# Altium schematic sheet 13 BOOT SELECT.SchDoc
size 513 x 386 mm
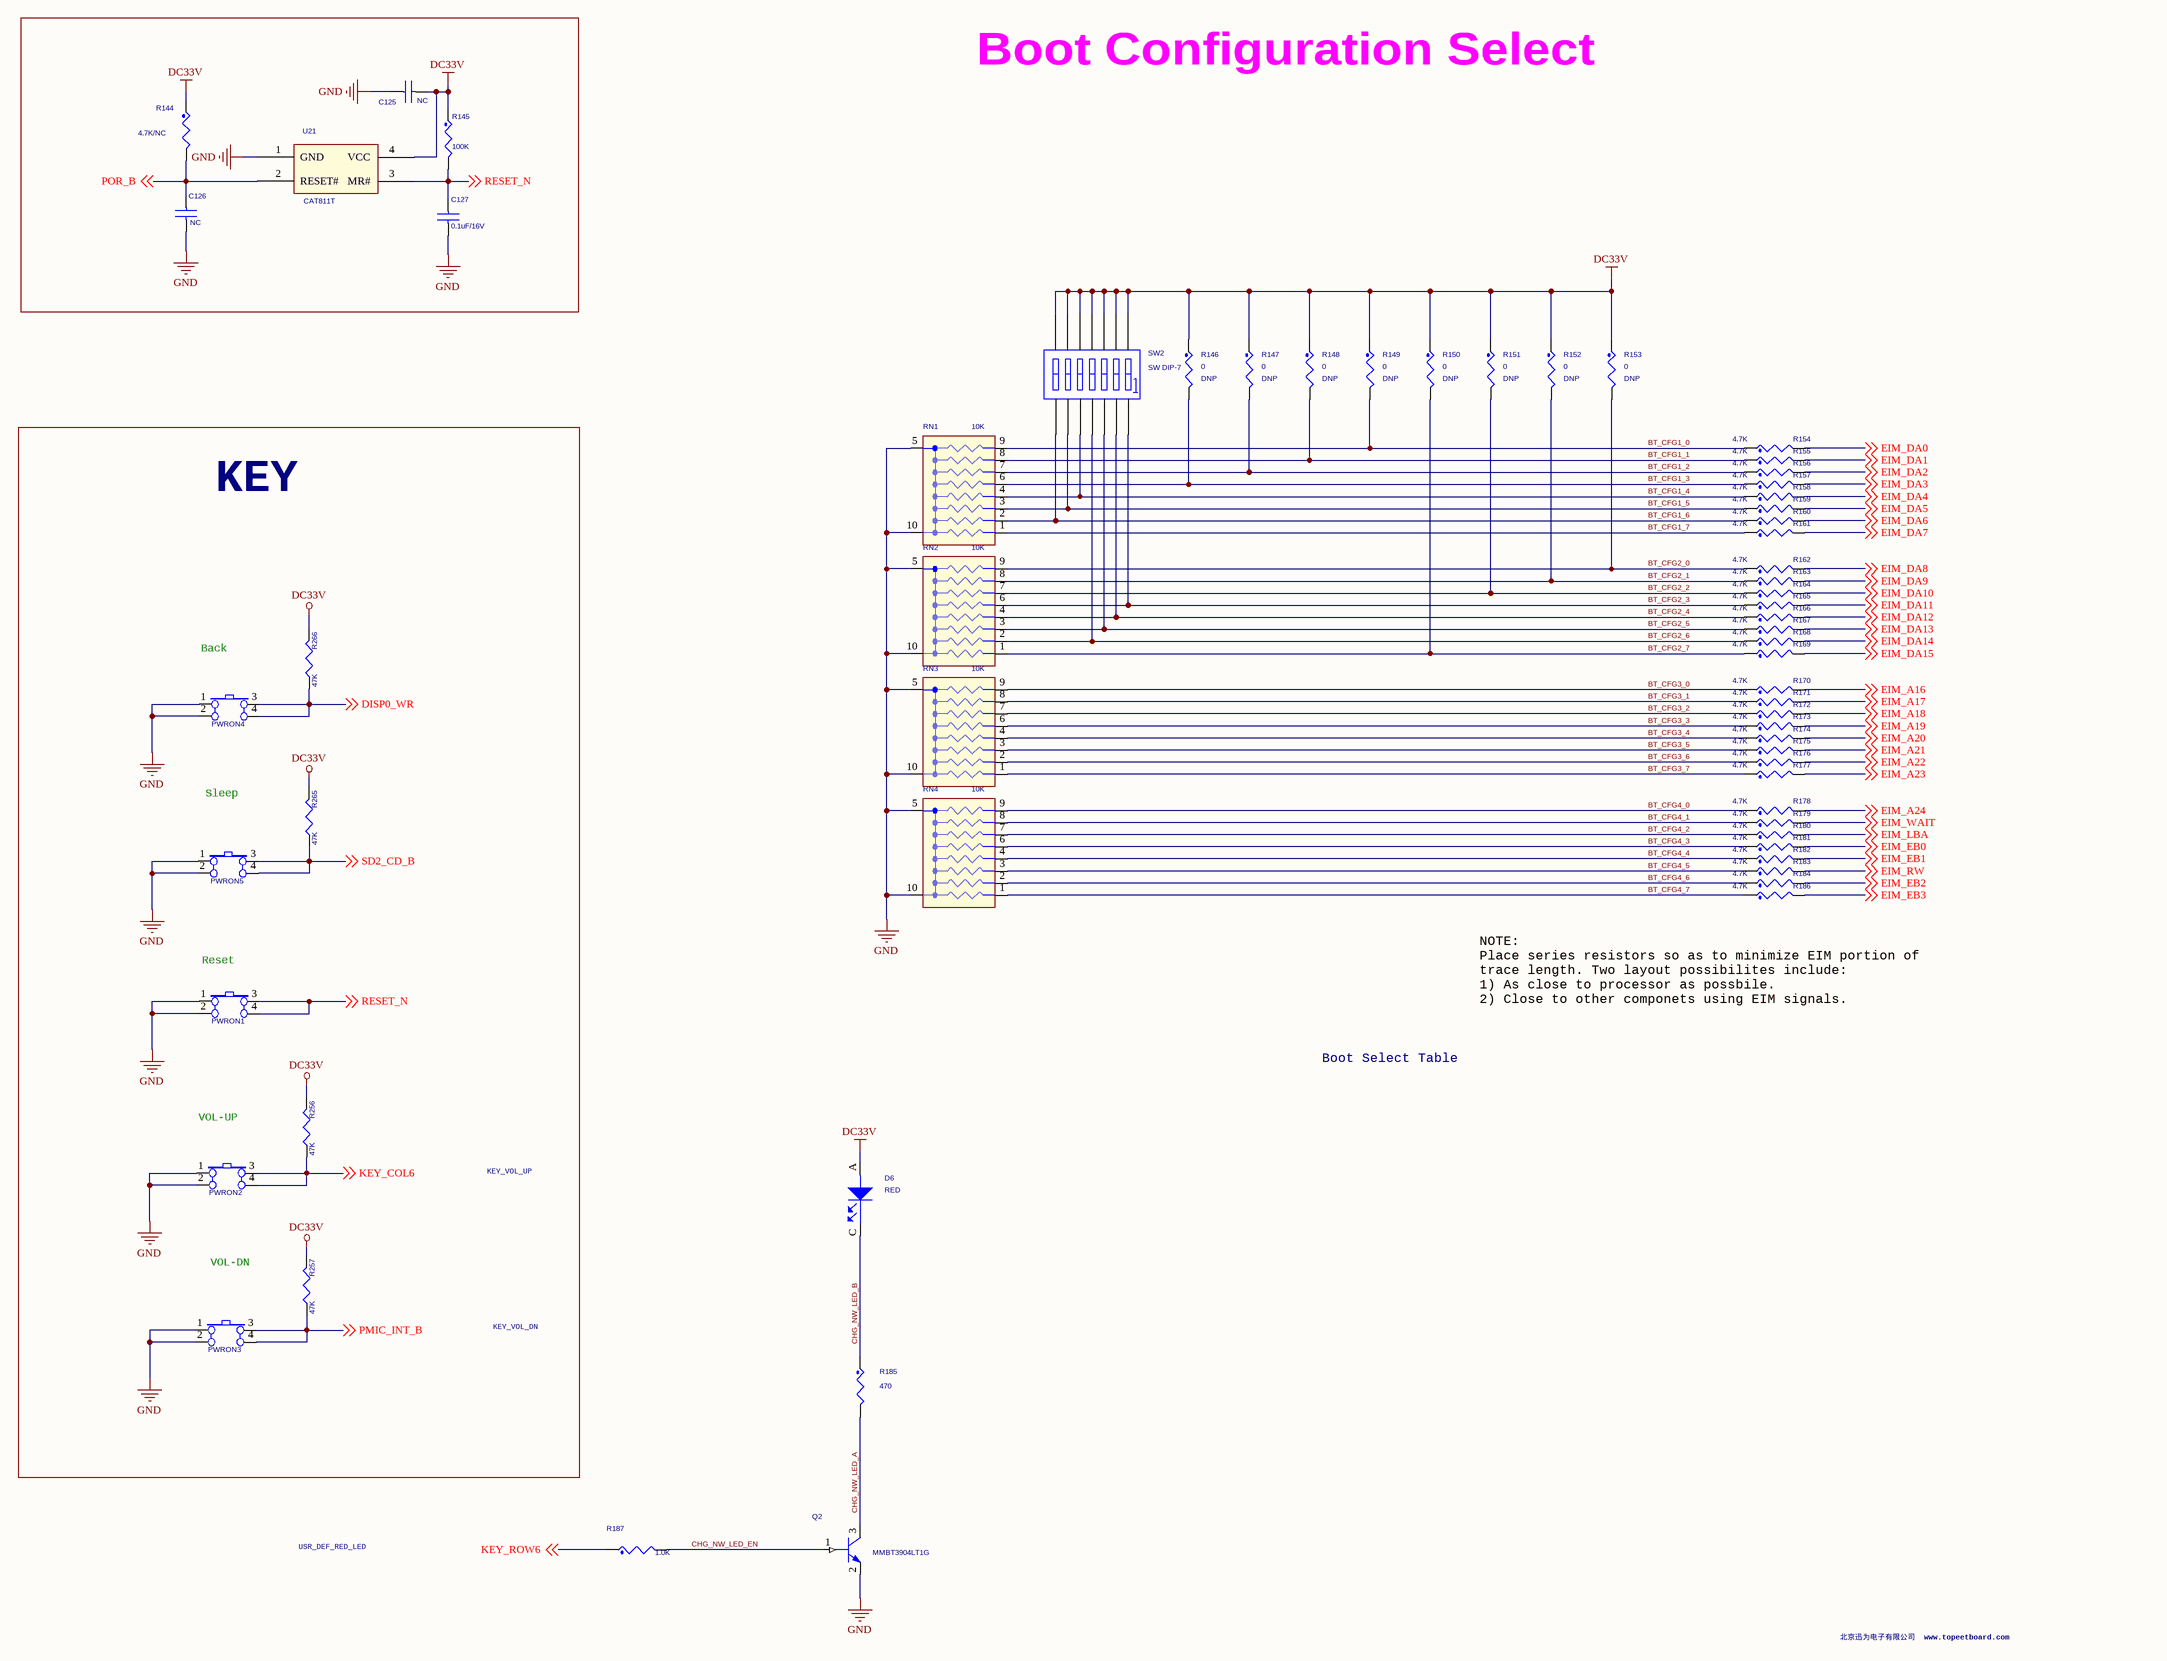
[diagram p0: 13 BOOT SELECT.SchDoc]

## Parts
C125  NC  [C0603]
C126  NC  [C0603]
C127  0.1uF/16V  [C0603]
D6  RED  [LED0603]
PWRON1  SW-TACT(RED)_1105S  [SW-TACT]  (value not drawn)
PWRON2  SW-TACT(RED)_1105S  [SW-TACT]  (value not drawn)
PWRON3  SW-TACT(RED)_1105S  [SW-TACT]  (value not drawn)
PWRON4  SW-TACT(RED)_1105S  [SW-TACT]  (value not drawn)
PWRON5  SW-TACT(RED)_1105S  [SW-TACT]  (value not drawn)
Q2  MMBT3904LT1G  [SOT23-mmbt3904]
R144  4.7K/NC  [R0402]
R145  100K  [R0402]
R146  0  ASSY_OPT: DNP  [R0402]
R147  0  ASSY_OPT: DNP  [R0402]
R148  0  ASSY_OPT: DNP  [R0402]
R149  0  ASSY_OPT: DNP  [R0402]
R150  0  ASSY_OPT: DNP  [R0402]
R151  0  ASSY_OPT: DNP  [R0402]
R152  0  ASSY_OPT: DNP  [R0402]
R153  0  ASSY_OPT: DNP  [R0402]
R154  4.7K  [R0402]
R155  4.7K  [R0402]
R156  4.7K  [R0402]
R157  4.7K  [R0402]
R158  4.7K  [R0402]
R159  4.7K  [R0402]
R160  4.7K  [R0402]
R161  4.7K  [R0402]
R162  4.7K  [R0402]
R163  4.7K  [R0402]
R164  4.7K  [R0402]
R165  4.7K  [R0402]
R166  4.7K  [R0402]
R167  4.7K  [R0402]
R168  4.7K  [R0402]
R169  4.7K  [R0402]
R170  4.7K  [R0402]
R171  4.7K  [R0402]
R172  4.7K  [R0402]
R173  4.7K  [R0402]
R174  4.7K  [R0402]
R175  4.7K  [R0402]
R176  4.7K  [R0402]
R177  4.7K  [R0402]
R178  4.7K  [R0402]
R179  4.7K  [R0402]
R180  4.7K  [R0402]
R181  4.7K  [R0402]
R182  4.7K  [R0402]
R183  4.7K  [R0402]
R184  4.7K  [R0402]
R185  470  [R0402]
R186  4.7K  [R0402]
R187  1.0K  [R0402]
R256  47K  [R1005]
R257  47K  [R1005]
R265  47K  [R1005]
R266  47K  [R1005]
RN1  10K  [RCA_8_10]
RN2  10K  [RCA_8_10]
RN3  10K  [RCA_8_10]
RN4  10K  [RCA_8_10]
SW2  SW DIP-7  [bmkg7]
U21  CAT811T  [sot143_CAT811T]

## Blocks framed on the sheet
KEY: PWRON1-PWRON5 R256 R257 R265 R266

## Nets
DC33V: C125.2 D6.A(ANODE) R144.1 R145.1 R146.1 R147.1 R148.1 R149.1 R150.1 R151.1 R152.1 R153.1 R256.2 R257.2 R265.2 R266.2 SW2.1(A1) SW2.2(A2) SW2.3(A3) SW2.4(A4) SW2.5(A5) SW2.6(A6) SW2.7(A7) U21.4(VCC)
GND: C125.1 C126.2 C127.2 PWRON1.1(I2) PWRON1.2(I3) PWRON2.1(I2) PWRON2.2(I3) PWRON3.1(I2) PWRON3.2(I3) PWRON4.1(I2) PWRON4.2(I3) PWRON5.1(I2) PWRON5.2(I3) Q2.2(EMITTER) RN1.5 RN1.10 RN2.5 RN2.10 RN3.5 RN3.10 RN4.5 RN4.10 U21.1(GND)
BT_CFG1_0: R149.2 R154.1 RN1.9
BT_CFG1_1: R148.2 R155.1 RN1.8
BT_CFG1_2: R147.2 R156.1 RN1.7
BT_CFG1_3: R146.2 R157.1 RN1.6
BT_CFG1_4: R158.1 RN1.4 SW2.10(B5)
BT_CFG1_5: R159.1 RN1.3 SW2.9(B6)
BT_CFG1_6: R160.1 RN1.2 SW2.8(B7)
BT_CFG1_7: R161.1 RN1.1
BT_CFG2_0: R153.2 R162.1 RN2.9
BT_CFG2_1: R152.2 R163.1 RN2.8
BT_CFG2_2: R151.2 R164.1 RN2.7
BT_CFG2_3: R165.1 RN2.6 SW2.14(B1)
BT_CFG2_4: R166.1 RN2.4 SW2.13(B2)
BT_CFG2_5: R167.1 RN2.3 SW2.12(B3)
BT_CFG2_6: R168.1 RN2.2 SW2.11(B4)
BT_CFG2_7: R150.2 R169.1 RN2.1
BT_CFG3_0: R170.1 RN3.9
BT_CFG3_1: R171.1 RN3.8
BT_CFG3_2: R172.1 RN3.7
BT_CFG3_3: R173.1 RN3.6
BT_CFG3_4: R174.1 RN3.4
BT_CFG3_5: R175.1 RN3.3
BT_CFG3_6: R176.1 RN3.2
BT_CFG3_7: R177.1 RN3.1
BT_CFG4_0: R178.1 RN4.9
BT_CFG4_1: R179.1 RN4.8
BT_CFG4_2: R180.1 RN4.7
BT_CFG4_3: R181.1 RN4.6
BT_CFG4_4: R182.1 RN4.4
BT_CFG4_5: R183.1 RN4.3
BT_CFG4_6: R184.1 RN4.2
BT_CFG4_7: R186.1 RN4.1
CHG_NW_LED_A: Q2.3(COLLECTOR) R185.2
CHG_NW_LED_B: D6.C(CATHODE) R185.1
CHG_NW_LED_EN: Q2.1(BASE) R187.2
DISP0_WR: PWRON4.3 PWRON4.4(I1) R266.1 ; off-sheet DISP0_WR
EIM_A16: R170.2 ; off-sheet EIM_A16
EIM_A17: R171.2 ; off-sheet EIM_A17
EIM_A18: R172.2 ; off-sheet EIM_A18
EIM_A19: R173.2 ; off-sheet EIM_A19
EIM_A20: R174.2 ; off-sheet EIM_A20
EIM_A21: R175.2 ; off-sheet EIM_A21
EIM_A22: R176.2 ; off-sheet EIM_A22
EIM_A23: R177.2 ; off-sheet EIM_A23
EIM_A24: R178.2 ; off-sheet EIM_A24
EIM_DA0: R154.2 ; off-sheet EIM_DA0
EIM_DA1: R155.2 ; off-sheet EIM_DA1
EIM_DA2: R156.2 ; off-sheet EIM_DA2
EIM_DA3: R157.2 ; off-sheet EIM_DA3
EIM_DA4: R158.2 ; off-sheet EIM_DA4
EIM_DA5: R159.2 ; off-sheet EIM_DA5
EIM_DA6: R160.2 ; off-sheet EIM_DA6
EIM_DA7: R161.2 ; off-sheet EIM_DA7
EIM_DA8: R162.2 ; off-sheet EIM_DA8
EIM_DA9: R163.2 ; off-sheet EIM_DA9
EIM_DA10: R164.2 ; off-sheet EIM_DA10
EIM_DA11: R165.2 ; off-sheet EIM_DA11
EIM_DA12: R166.2 ; off-sheet EIM_DA12
EIM_DA13: R167.2 ; off-sheet EIM_DA13
EIM_DA14: R168.2 ; off-sheet EIM_DA14
EIM_DA15: R169.2 ; off-sheet EIM_DA15
EIM_EB0: R181.2 ; off-sheet EIM_EB0
EIM_EB1: R182.2 ; off-sheet EIM_EB1
EIM_EB2: R184.2 ; off-sheet EIM_EB2
EIM_EB3: R186.2 ; off-sheet EIM_EB3
EIM_LBA: R180.2 ; off-sheet EIM_LBA
EIM_RW: R183.2 ; off-sheet EIM_RW
EIM_WAIT: R179.2 ; off-sheet EIM_WAIT
KEY_COL6: PWRON2.3 PWRON2.4(I1) R256.1 ; off-sheet KEY_COL6
KEY_ROW6: R187.1 ; off-sheet KEY_ROW6
PMIC_INT_B: PWRON3.3 PWRON3.4(I1) R257.1 ; off-sheet PMIC_INT_B
POR_B: C126.1 R144.2 U21.2(RESET#) ; off-sheet POR_B
RESET_N: C127.1 PWRON1.3 PWRON1.4(I1) R145.2 U21.3(MR#) ; off-sheet RESET_N
SD2_CD_B: PWRON5.3 PWRON5.4(I1) R265.1 ; off-sheet SD2_CD_B

## Notes on the sheet
- Boot Configuration Select
- Back
- Sleep
- NOTE:
  Place series resistors so as to minimize EIM portion of
  trace length. Two layout possibilites include:
  1) As close to processor as possbile.
  2) Close to other componets using EIM signals.
- (near PWRON1) Reset
- Boot Select Table
- VOL-UP
- KEY_VOL_UP
- VOL-DN
- KEY_VOL_DN
- USR_DEF_RED_LED
- 北京迅为电子有限公司  www.topeetboard.com

## Library data of the parts
C125-C127 = C0603_0_Dup1
D6 = LED: LED ULTRA BRIGHT RED SGL 30MA 0603; CAD_APPROVED: Yes; MFG_PN01: LTST-C190KRKT; MFG_NAME01: LITE ON; AGILE_PN: 370-75079; HEIGHT: 0.9MM; ROHS: Yes
PWRON1-PWRON5 = SW-TACT
Q2 = NPN: TRAN NPN GEN 200MA 40V SOT-23; CAD_APPROVED: Yes; MFG_NAME01: ON SEMICONDUCTOR; AGILE_PN: 480-75173; HEIGHT: 1.12 MM; ROHS: Yes; MFG_PN01: MMBT3904LT1G
R144 R185 = RES_Dup1: RES MF 470 OHM 1/10W 1% 0603; SIGNAL_MODEL: DEFAULT_RESISTOR_470OHM_2_1; FPLIST: RC0603_OV,RC0603,0603_CC; CAD_APPROVED: Yes; MFG_PN01: RK73H1JTTD4700F; MFG_NAME01: KOA SPEER; AGILE_PN: 470-30133; HEIGHT: 0.55 MM; ROHS: Yes; TOL: 1%; Tolerance: 1%
R145 = RES_Dup1: RES MF 470 OHM 1/10W 1% 0603; AGILE_PN: 470-30133; MFG_NAME01: KOA SPEER; MFG_PN01: RK73H1JTTD4700F; CAD_APPROVED: Yes; FPLIST: RC0603_OV,RC0603,0603_CC; SIGNAL_MODEL: DEFAULT_RESISTOR_470OHM_2_1; Tolerance: 1%; TOL: 1%; ROHS: Yes; HEIGHT: 0.55 MM
R146-R153 = RES_Dup1: RES MF ZERO OHM 1/10W -- 0402; SIGNAL_MODEL: DEFAULT_RESISTOR_0.001OHM_2_1; FPLIST: RC0402_25,RC0402_HD,RC0402_X2,0402_CC; CAD_APPROVED: Yes; MFG_PN01: ERJ-2GE0R00X; MFG_NAME01: Panasonic; AGILE_PN: 470-79965; ROHS: Yes
R154-R161 R163-R170 R178 = RES_Dup1: RES MF 4.70K 1/16W 1% 0402; AGILE_PN: 470-75418; MFG_NAME01: KOA SPEER; MFG_PN01: RK73H1ETTP4701F; CAD_APPROVED: Yes; PRIORITY_PN: 006-00619; SIGNAL_MODEL: DEFAULT_RESISTOR_4700OHM_2_1; Tolerance: 1%; ROHS: Yes
R162 R171-R177 R179-R184 R186 = RES_Dup1: RES MF 4.70K 1/16W 1% 0402; PRIORITY_PN: 006-00619; CAD_APPROVED: Yes; MFG_PN01: RK73H1ETTP4701F; MFG_NAME01: KOA SPEER; AGILE_PN: 470-75418; SIGNAL_MODEL: DEFAULT_RESISTOR_4700OHM_2_1; ROHS: Yes; Tolerance: 1%
R187 = RES_Dup1: RES MF 1.0K 1/16W 1% 0402; AGILE_PN: 470-76037; MFG_NAME01: YAGEO AMERICA; MFG_PN01: RC0402FR-071KL; CAD_APPROVED: Yes; FPLIST: RC0402_25,RC0402_HD,RC0402_X2,0402_CC; SIGNAL_MODEL: DEFAULT_RESISTOR_1000OHM_2_1; Tolerance: 1%; ROHS: Yes
R256 R257 R265 R266 = R1005_0_Dup2
RN1 RN2 = NETW_B8_10P: RNET BUS 8 10K 1/32W 5% SMT; PRIORITY_PN: 051-00078; FPLIST: RCA_8_10, mnr15; CAD_APPROVED: Yes; MFG_PN01: MNR15E0RPJ103; MFG_NAME01: ROHM; AGILE_PN: 470-75833; ROHS: Yes; Tolerance: 5%
RN3 RN4 = NETW_B8_10P: RNET BUS 8 10K 1/32W 5% SMT; AGILE_PN: 470-75833; MFG_NAME01: ROHM; MFG_PN01: MNR15E0RPJ103; CAD_APPROVED: Yes; FPLIST: RCA_8_10, mnr15; PRIORITY_PN: 051-00078; Tolerance: 5%; ROHS: Yes